# EAGLE schematic Automatic_Stair_Climber (EAGLE 6.5.0)
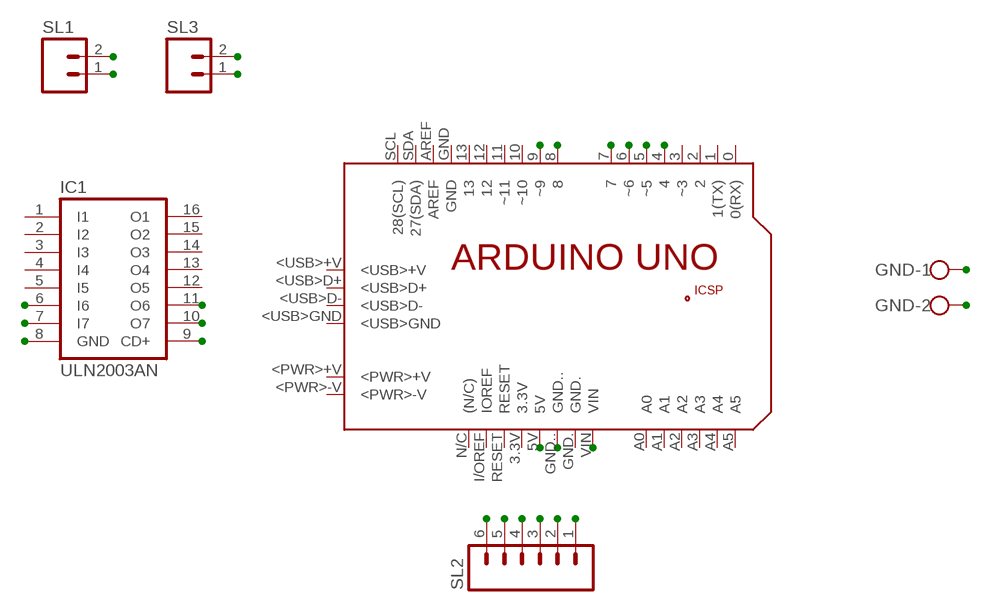
[diagram p0: schematic, sheet 1]

## Parts
GND  W237-102  [W237-102]
IC1  ULN2003AN  [DIL16]
PCB1  ARDUINO_UNO  [ARDUINO_UNO]
SL1  MA02  [02PA]
SL2  MA06  [06PA]
SL3  MA02  [02PA]

## Nets
5V: PCB1.5V SL2.5
8: IC1.6(I6) PCB1.8
9: IC1.7(I7) PCB1.9(~9)
12V: GND.2 IC1.9(CD+) PCB1.VIN SL1.1 SL3.1
GND: GND.1 IC1.8(GND) PCB1.GND.. SL2.6
SL12: IC1.11(O6) SL1.2
SL21: PCB1.4 SL2.1
SL22: PCB1.5(~5) SL2.2
SL23: PCB1.7 SL2.3
SL24: PCB1.6(~6) SL2.4
SL32: IC1.10(O7) SL3.2
Unconnected: IC1.1(I1) IC1.2(I2) IC1.3(I3) IC1.4(I4) IC1.5(I5) IC1.12(O5) IC1.13(O4) IC1.14(O3) IC1.15(O2) IC1.16(O1) PCB1.0(0(RX)) PCB1.1(1(TX)) PCB1.2 PCB1.3(~3) PCB1.3.3V PCB1.10(~10) PCB1.11(~11) PCB1.12 PCB1.13 PCB1.+5V PCB1.<PWR>+V PCB1.<PWR>-V PCB1.<USB>+V PCB1.<USB>D+ PCB1.<USB>D- PCB1.<USB>GND PCB1.A0 PCB1.A1 PCB1.A2 PCB1.A3 PCB1.A4 PCB1.A5 PCB1.AREF PCB1.GND PCB1.GND. PCB1.GND_ PCB1.I/OREF(IOREF) PCB1.MISO PCB1.MOSI PCB1.N/C((N/C)) PCB1.RESET PCB1.RESET. PCB1.SCK PCB1.SCL(28(SCL)) PCB1.SDA(27(SDA))

## Library data of the parts
GND = con-wago-500:W237-102: WAGO SCREW CLAMP; MPN: 237-102; OC_FARNELL: unknown; OC_NEWARK: 70K9898
IC1 = uln-udn:ULN2003A: DRIVER ARRAY
PCB1 = E14_Arduino_revB:ARDUINO_UNO: Device for representing an Arduino Uno board with a footprint in an EAGLE design. Created by Dave Young for Element14. More EAGLE documentation at: http://www.element14.com/community/community/knode/cadsoft_eagle
SL1 SL3 = con-amp-quick:MA02: AMP QUICK CONNECTOR; OC_FARNELL: unknown; OC_NEWARK: unknown
SL2 = con-amp-quick:MA06: AMP QUICK CONNECTOR; OC_FARNELL: unknown; OC_NEWARK: unknown